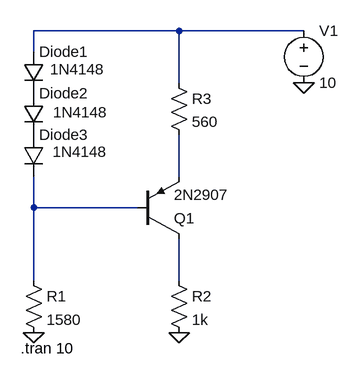
[diagram p0: schematic Aufgabe1.asc]
Aufgabe1.asc, the LTspice schematic file:
Version 4
SHEET 1 880 888
WIRE 336 384 112 384
WIRE 528 384 336 384
WIRE 112 416 112 384
WIRE 336 464 336 384
WIRE 336 608 336 544
WIRE 112 656 112 608
WIRE 272 656 112 656
WIRE 112 768 112 656
WIRE 336 768 336 704
FLAG 112 848 0
FLAG 336 848 0
FLAG 528 464 0
SYMBOL diode 96 416 R0
WINDOW 3 41 27 Left 2
SYMATTR InstName Diode1
SYMATTR Value 1N4148
SYMBOL diode 96 480 R0
WINDOW 3 46 29 Left 2
SYMATTR InstName Diode2
SYMATTR Value 1N4148
SYMBOL diode 96 544 R0
WINDOW 3 45 26 Left 2
SYMATTR InstName Diode3
SYMATTR Value 1N4148
SYMBOL res 96 752 R0
SYMATTR InstName R1
SYMATTR Value 1580
SYMBOL res 320 752 R0
SYMATTR InstName R2
SYMATTR Value 1k
SYMBOL pnp 272 704 M180
SYMATTR InstName Q1
SYMATTR Value 2N2907
SYMBOL res 320 448 R0
SYMATTR InstName R3
SYMATTR Value 560
SYMBOL voltage 528 368 R0
WINDOW 123 0 0 Left 0
WINDOW 39 0 0 Left 0
SYMATTR InstName V1
SYMATTR Value 10
TEXT 92 872 Left 2 !.tran 10

The netlist it stands for:
* Aufgabe1.asc
Diode1 N001 P001 1N4148
Diode2 P001 P002 1N4148
Diode3 P002 N003 1N4148
R1 N003 0 1580
R2 N004 0 1k
Q1 N004 N003 N002 0 2N2907
R3 N001 N002 560
V1 N001 0 10
.model D D
.lib standard.dio
.model NPN NPN
.model PNP PNP
.lib standard.bjt
.tran 10
.backanno
.end